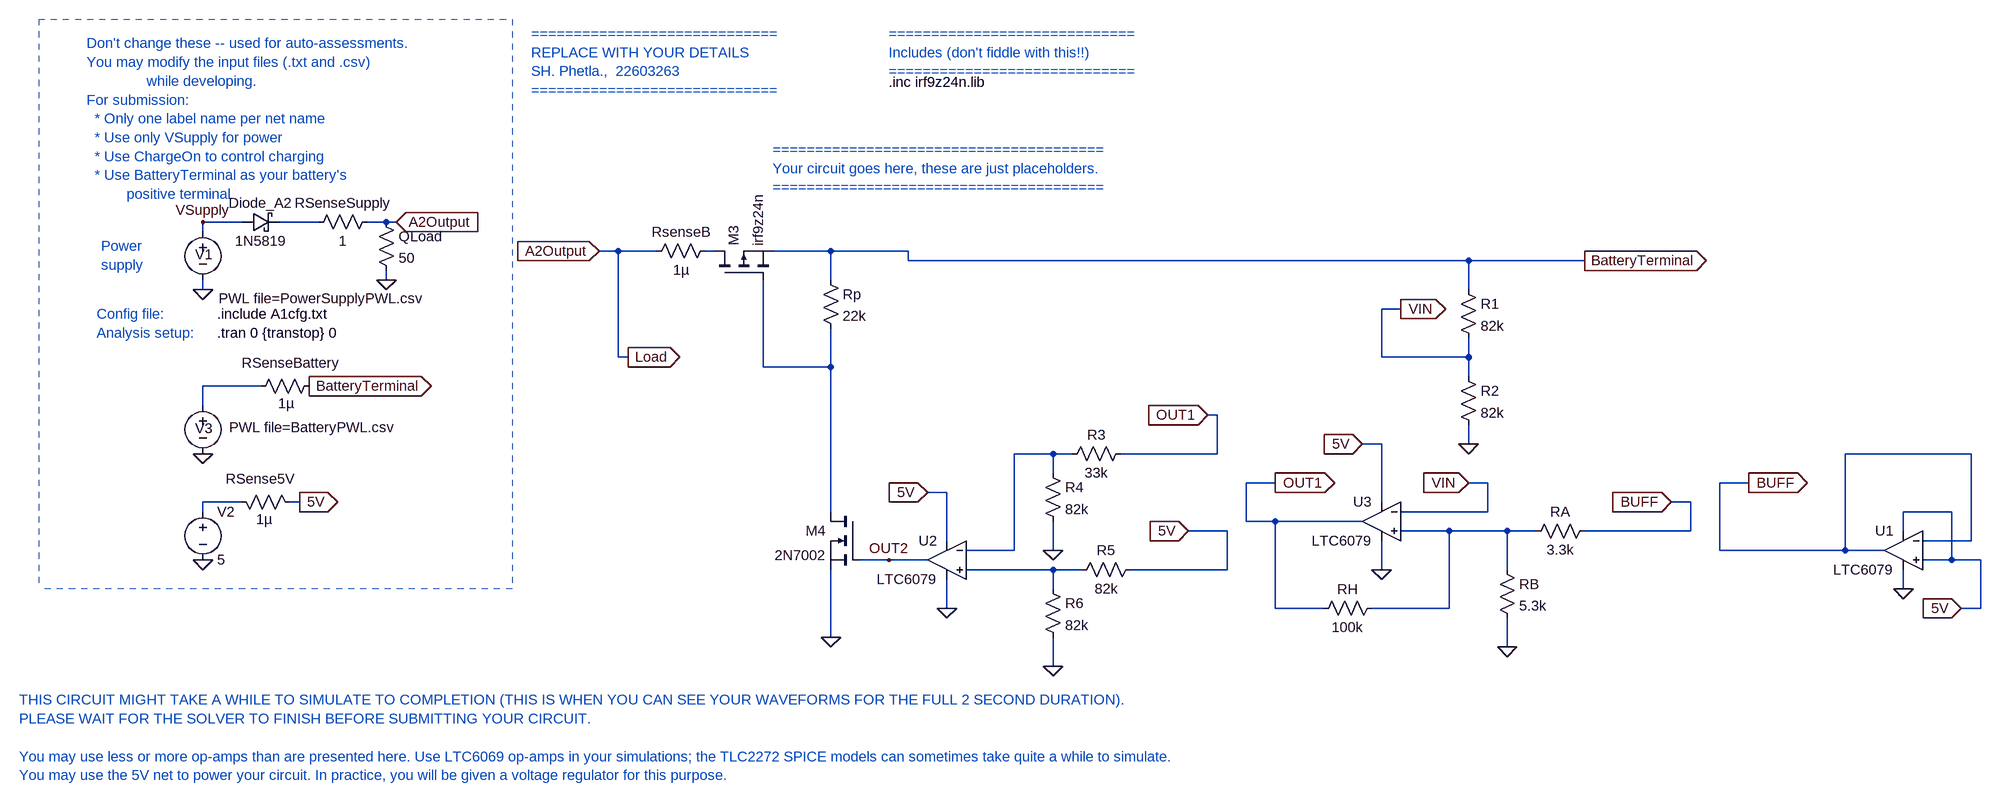
[diagram p0: schematic E344_22603263_A3.asc]
E344_22603263_A3.asc, the LTspice schematic file:
Version 4
SHEET 1 2008 680
WIRE -2032 -1088 -2096 -1088
WIRE -1904 -1088 -1968 -1088
WIRE -1792 -1088 -1824 -1088
WIRE -1776 -1088 -1792 -1088
WIRE -2096 -1072 -2096 -1088
WIRE -1408 -1040 -1440 -1040
WIRE -1344 -1040 -1408 -1040
WIRE -1248 -1040 -1264 -1040
WIRE -1056 -1040 -1152 -1040
WIRE -928 -1040 -1056 -1040
WIRE -928 -1024 -928 -1040
WIRE 0 -1024 -928 -1024
WIRE 192 -1024 0 -1024
WIRE -1792 -992 -1792 -1008
WIRE -1056 -992 -1056 -1040
WIRE -2096 -976 -2096 -992
WIRE 0 -976 0 -1024
WIRE -112 -944 -144 -944
WIRE -1408 -864 -1408 -1040
WIRE -1392 -864 -1408 -864
WIRE -144 -864 -144 -944
WIRE 0 -864 0 -896
WIRE 0 -864 -144 -864
WIRE -1168 -848 -1168 -992
WIRE -1056 -848 -1056 -912
WIRE -1056 -848 -1168 -848
WIRE 0 -832 0 -864
WIRE -2000 -816 -2096 -816
WIRE -2096 -784 -2096 -816
WIRE -416 -768 -432 -768
WIRE -144 -720 -176 -720
WIRE 0 -720 0 -752
WIRE -688 -704 -752 -704
WIRE -656 -704 -688 -704
WIRE -416 -704 -416 -768
WIRE -416 -704 -576 -704
WIRE 832 -704 624 -704
WIRE -688 -672 -688 -704
WIRE -320 -656 -368 -656
WIRE 32 -656 0 -656
WIRE 464 -656 416 -656
WIRE -864 -640 -896 -640
WIRE -2032 -624 -2096 -624
WIRE -1936 -624 -1952 -624
WIRE -144 -624 -144 -720
WIRE 368 -624 336 -624
WIRE -2096 -608 -2096 -624
WIRE -1056 -608 -1056 -848
WIRE 32 -608 32 -656
WIRE 32 -608 -112 -608
WIRE 800 -608 720 -608
WIRE -368 -592 -368 -656
WIRE -320 -592 -368 -592
WIRE -176 -592 -320 -592
WIRE -400 -576 -464 -576
WIRE -32 -576 -112 -576
WIRE 64 -576 -32 -576
WIRE 112 -576 64 -576
WIRE 368 -576 368 -624
WIRE 368 -576 192 -576
WIRE 720 -576 720 -608
WIRE -864 -560 -864 -640
WIRE 832 -560 832 -704
WIRE 832 -560 752 -560
WIRE -752 -544 -752 -704
WIRE -752 -544 -832 -544
WIRE -688 -544 -688 -592
WIRE 416 -544 416 -656
WIRE 624 -544 624 -704
WIRE 624 -544 416 -544
WIRE 688 -544 624 -544
WIRE -960 -528 -1008 -528
WIRE -896 -528 -960 -528
WIRE 800 -528 800 -608
WIRE 800 -528 752 -528
WIRE 848 -528 800 -528
WIRE -688 -512 -832 -512
WIRE -640 -512 -688 -512
WIRE -400 -512 -400 -576
WIRE -400 -512 -560 -512
WIRE -144 -512 -144 -560
WIRE 64 -512 64 -576
WIRE -688 -480 -688 -512
WIRE 720 -480 720 -512
WIRE -864 -448 -864 -496
WIRE -320 -448 -320 -592
WIRE -240 -448 -320 -448
WIRE -32 -448 -32 -576
WIRE -32 -448 -160 -448
WIRE 848 -448 848 -528
WIRE 848 -448 816 -448
WIRE -1056 -400 -1056 -512
WIRE 64 -384 64 -432
WIRE -688 -352 -688 -400
FLAG -2096 -976 0
FLAG -1776 -1088 A2Output
IOPIN -1776 -1088 In
FLAG -1920 -816 BatteryTerminal
IOPIN -1920 -816 Out
FLAG -2096 -704 0
FLAG -1936 -624 5V
IOPIN -1936 -624 Out
FLAG -2096 -1088 VSupply
FLAG -1792 -992 0
FLAG -2096 -528 0
FLAG 192 -1024 BatteryTerminal
IOPIN 192 -1024 Out
FLAG -1440 -1040 A2Output
IOPIN -1440 -1040 In
FLAG -176 -720 5V
IOPIN -176 -720 In
FLAG -688 -544 0
FLAG -688 -352 0
FLAG -896 -640 5V
IOPIN -896 -640 In
FLAG -464 -576 5V
IOPIN -464 -576 In
FLAG 816 -448 5V
IOPIN 816 -448 In
FLAG -432 -768 OUT1
IOPIN -432 -768 In
FLAG -1056 -400 0
FLAG -320 -656 OUT1
IOPIN -320 -656 Out
FLAG -144 -512 0
FLAG 0 -656 VIN
IOPIN 0 -656 In
FLAG 64 -384 0
FLAG 336 -624 BUFF
IOPIN 336 -624 In
FLAG -864 -448 0
FLAG 464 -656 BUFF
IOPIN 464 -656 Out
FLAG 720 -480 0
FLAG -112 -944 VIN
IOPIN -112 -944 Out
FLAG 0 -720 0
FLAG -1392 -864 Load
IOPIN -1392 -864 Out
FLAG -960 -528 OUT2
SYMBOL voltage -2096 -1088 R0
WINDOW 123 0 0 Left 0
WINDOW 39 0 0 Left 0
WINDOW 3 26 127 Left 2
WINDOW 0 -13 54 Left 2
SYMATTR Value PWL file=PowerSupplyPWL.csv
SYMATTR InstName V1
SYMBOL res -1904 -832 R90
WINDOW 0 -7 47 VBottom 2
WINDOW 3 29 54 VTop 2
SYMATTR InstName RSenseBattery
SYMATTR Value 1µ
SYMBOL schottky -2032 -1072 R270
WINDOW 0 32 32 VTop 2
WINDOW 3 0 32 VBottom 2
SYMATTR InstName Diode_A2
SYMATTR Value 1N5819
SYMATTR Description Diode
SYMATTR Type diode
SYMBOL voltage -2096 -800 R0
WINDOW 123 0 0 Left 0
WINDOW 39 0 0 Left 0
WINDOW 3 44 52 Left 2
WINDOW 0 -13 54 Left 2
SYMATTR Value PWL file=BatteryPWL.csv
SYMATTR InstName V3
SYMBOL res -1920 -1072 R270
WINDOW 0 32 56 VTop 2
WINDOW 3 0 56 VBottom 2
SYMATTR InstName RSenseSupply
SYMATTR Value 1
SYMBOL res -1808 -1104 R0
SYMATTR InstName QLoad
SYMATTR Value 50
SYMBOL voltage -2096 -624 R0
WINDOW 123 0 0 Left 0
WINDOW 39 0 0 Left 0
SYMATTR InstName V2
SYMATTR Value 5
SYMBOL res -2048 -640 M90
WINDOW 0 -7 47 VBottom 2
WINDOW 3 29 54 VTop 2
SYMATTR InstName RSense5V
SYMATTR Value 1µ
SYMBOL pmos -1248 -992 R270
SYMATTR InstName M3
SYMATTR Value irf9z24n
SYMATTR Prefix X
SYMATTR SpiceModel irf9z24n
SYMBOL nmos -1008 -608 M0
SYMATTR InstName M4
SYMATTR Value 2N7002
SYMBOL OpAmps\\LTC6079 720 -544 M0
SYMATTR InstName U1
SYMBOL OpAmps\\LTC6079 -864 -528 M0
SYMATTR InstName U2
SYMBOL OpAmps\\LTC6079 -144 -592 M0
SYMATTR InstName U3
SYMBOL res -1072 -1008 R0
SYMATTR InstName Rp
SYMATTR Value 22k
SYMBOL res -704 -688 R0
SYMATTR InstName R4
SYMATTR Value 82k
SYMBOL res -560 -720 R90
WINDOW 0 0 56 VBottom 2
WINDOW 3 32 56 VTop 2
SYMATTR InstName R3
SYMATTR Value 33k
SYMBOL res -656 -496 R270
WINDOW 0 32 56 VTop 2
WINDOW 3 0 56 VBottom 2
SYMATTR InstName R5
SYMATTR Value 82k
SYMBOL res -704 -496 R0
SYMATTR InstName R6
SYMATTR Value 82k
SYMBOL res -144 -464 R90
WINDOW 0 0 56 VBottom 2
WINDOW 3 32 56 VTop 2
SYMATTR InstName RH
SYMATTR Value 100k
SYMBOL res 48 -528 R0
SYMATTR InstName RB
SYMATTR Value 5.3k
SYMBOL res 208 -592 R90
WINDOW 0 0 56 VBottom 2
WINDOW 3 32 56 VTop 2
SYMATTR InstName RA
SYMATTR Value 3.3k
SYMBOL res -16 -992 R0
SYMATTR InstName R1
SYMATTR Value 82k
SYMBOL res -16 -848 R0
SYMATTR InstName R2
SYMATTR Value 82k
SYMBOL res -1248 -1056 R90
WINDOW 0 0 56 VBottom 2
WINDOW 3 32 56 VTop 2
SYMATTR InstName RsenseB
SYMATTR Value 1µ
TEXT -2072 -904 Left 2 !.tran 0 {transtop} 0
TEXT -2072 -936 Left 2 !.include A1cfg.txt
TEXT -2288 -1384 Left 2 ;Don't change these -- used for auto-assessments.\nYou may modify the input files (.txt and .csv) \n               while developing.\nFor submission: \n  * Only one label name per net name\n  * Use only VSupply for power\n  * Use ChargeOn to control charging\n  * Use BatteryTerminal as your battery's \n          positive terminal
TEXT -2272 -936 Left 2 ;Config file:
TEXT -2272 -904 Left 2 ;Analysis setup:
TEXT -2264 -1048 Left 2 ;Power\nsupply
TEXT -1552 -1400 Left 2 ;=============================\nREPLACE WITH YOUR DETAILS\nSH. Phetla.,  22603263\n=============================
TEXT -960 -1320 Left 2 !.inc irf9z24n.lib
TEXT -960 -1400 Left 2 ;=============================\nIncludes (don't fiddle with this!!)\n=============================
TEXT -1152 -1208 Left 2 ;=======================================\nYour circuit goes here, these are just placeholders.\n=======================================
TEXT -2400 -296 Left 2 ;THIS CIRCUIT MIGHT TAKE A WHILE TO SIMULATE TO COMPLETION (THIS IS WHEN YOU CAN SEE YOUR WAVEFORMS FOR THE FULL 2 SECOND DURATION).\nPLEASE WAIT FOR THE SOLVER TO FINISH BEFORE SUBMITTING YOUR CIRCUIT.\n \nYou may use less or more op-amps than are presented here. Use LTC6069 op-amps in your simulations; the TLC2272 SPICE models can sometimes take quite a while to simulate.\nYou may use the 5V net to power your circuit. In practice, you will be given a voltage regulator for this purpose.
LINE Normal -1584 -1424 -1584 -480 2
LINE Normal -2368 -1424 -1584 -1424 2
LINE Normal -1584 -480 -2368 -480 2
LINE Normal -1584 -496 -1584 -496 2
LINE Normal -2368 -1424 -2368 -480 2

The netlist it stands for:
* E344_22603263_A3.asc
V1 VSupply 0 PWL file=PowerSupplyPWL.csv
RSenseBattery BatteryTerminal N004 1µ
Diode_A2 VSupply N001 1N5819
V3 N004 0 PWL file=BatteryPWL.csv
RSenseSupply N001 Load 1
R§QLoad Load 0 50
V2 N006 0 5
RSense5V N006 5V 1µ
XM3 N002 N003 BatteryTerminal irf9z24n irf9z24n  ; pins D G S
M4 N003 OUT2 0 0 2N7002
XU1 5V BUFF 5V 0 BUFF LTC6078  ; LTC6079, pins In+ In- V+ V- OUT
XU2 N008 N005 5V 0 OUT2 LTC6078  ; LTC6079, pins In+ In- V+ V- OUT
XU3 N007 VIN 5V 0 OUT1 LTC6078  ; LTC6079, pins In+ In- V+ V- OUT
Rp BatteryTerminal N003 22k
R4 N005 0 82k
R3 OUT1 N005 33k
R5 N008 5V 82k
R6 N008 0 82k
RH N007 OUT1 100k
RB N007 0 5.3k
RA BUFF N007 3.3k
R1 BatteryTerminal VIN 82k
R2 VIN 0 82k
RsenseB N002 Load 1µ
.model D D
.lib standard.dio
.model NMOS NMOS
.model PMOS PMOS
.lib standard.mos
.tran 0 {transtop} 0
.include A1cfg.txt
* Don't change these -- used for auto-assessments.
* You may modify the input files (.txt and .csv)
*                while developing.
* For submission:
*   * Only one label name per net name
*   * Use only VSupply for power
*   * Use ChargeOn to control charging
*   * Use BatteryTerminal as your battery's
*           positive terminal
* Config file:
* Analysis setup:
* Power
* supply
* =============================
* REPLACE WITH YOUR DETAILS
* SH. Phetla.,  22603263
* =============================
.inc irf9z24n.lib
* =============================
* Includes (don't fiddle with this!!)
* =============================
* =======================================
* Your circuit goes here, these are just placeholders.
* =======================================
* THIS CIRCUIT MIGHT TAKE A WHILE TO SIMULATE TO COMPLETION (THIS IS WHEN YOU CAN SEE YOUR WAVEFORMS FOR THE FULL 2 SECOND DURATION).
* PLEASE WAIT FOR THE SOLVER TO FINISH BEFORE SUBMITTING YOUR CIRCUIT.
* You may use less or more op-amps than are presented here. Use LTC6069 op-amps in your simulations; the TLC2272 SPICE models can sometimes take quite a while to simulate.
* You may use the 5V net to power your circuit. In practice, you will be given a voltage regulator for this purpose.
.lib LTC5.lib
.backanno
.end